# Altium schematic sheet PTC Fuse.SchDoc
size A; SheetNumber: 9; SheetTotal: 9
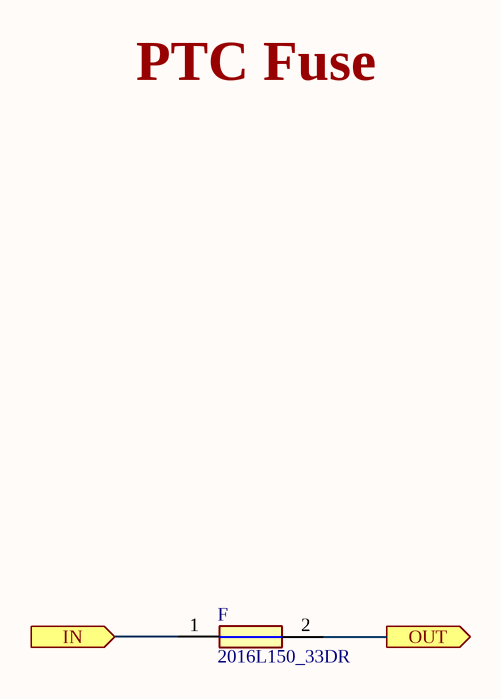
[diagram p0: PTC Fuse.SchDoc]

## Parts
F  2016L150_33DR  [FUSC5141X160N]

## Ports
IN (in), OUT (out)

## Nets
IN: F.1 ; port IN
OUT: F.2 ; port OUT

## Notes on the sheet
- PTC Fuse

## Library data of the parts
F = 2016L150_33DR: Fuse; Manufacturer_Name: LITTELFUSE; Manufacturer_Part_Number: 2016L150/33DR; Datasheet Link: https://componentsearchengine.com//2016L150_33DR.pdf; Height: 1.6mm; Mouser2 Part Number: 576-2016L150/33DR; Mouser2 Price/Stock: https://www.mouser.com/Search/Refine.aspx?Keyword=576-2016L150%2F33DR